# EAGLE design USBHost (EAGLE 5.10)
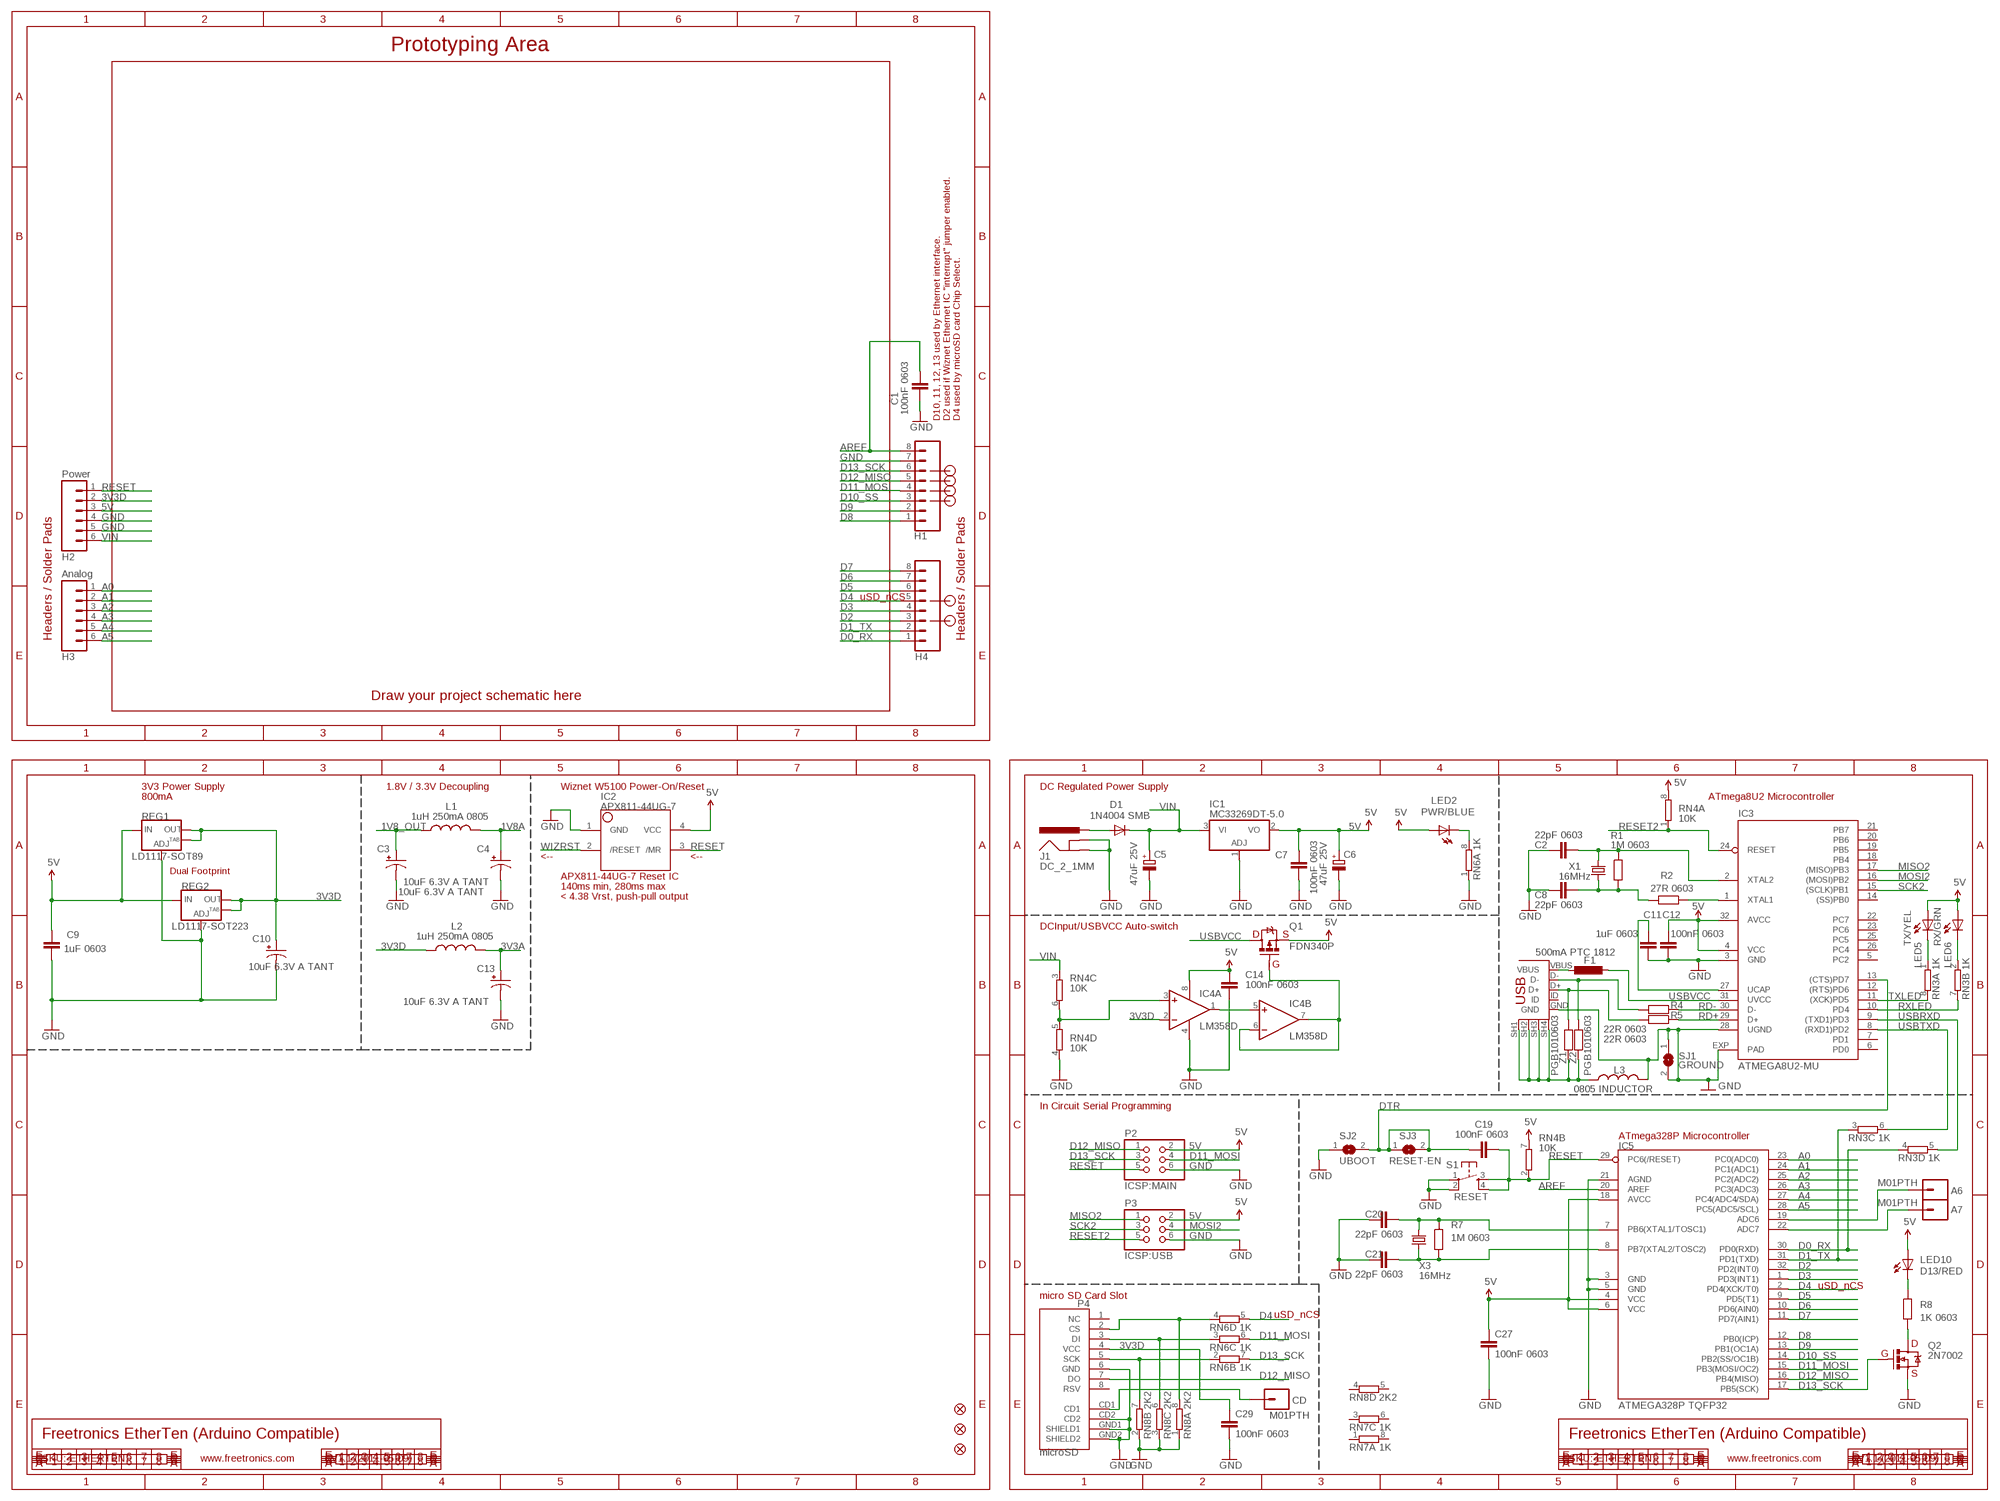
[diagram p0: schematic, sheet 1]

## Parts
A6  M01PTH  [1X01]
A7  M01PTH  [1X01]
C1  100nF 0603  CAP0603  [0603]
C2  22pF 0603  CAP0603  [0603]
C3  10uF 6.3V A TANT  CAP_POL1206  [EIA3216]
C4  10uF 6.3V A TANT  CAP_POL1206  [EIA3216]
C5  47uF 25V  CPOL-EUD  [PANASONIC_D]
C6  47uF 25V  CPOL-EUD  [PANASONIC_D]
C7  100nF 0603  CAP0603  [0603]
C8  22pF 0603  CAP0603  [0603]
C9  1uF 0603  CAP0603  [0603]
C10  10uF 6.3V A TANT  CAP_POL1206  [EIA3216]
C11  1uF 0603  CAP0603  [0603]
C12  100nF 0603  CAP0603  [0603]
C13  10uF 6.3V A TANT  CAP_POL1206  [EIA3216]
C14  100nF 0603  CAP0603  [0603]
C19  100nF 0603  CAP0603  [0603]
C20  22pF 0603  CAP0603  [0603]
C21  22pF 0603  CAP0603  [0603]
C27  100nF 0603  CAP0603  [0603]
C29  100nF 0603  CAP0603  [0603]
CD  M01PTH  [1X01]
D1  1N4004 SMB  DIODESMB  [SMB-DIODE]
F1  500mA PTC 1812  L-EUL1812  [L1812]
FID1  FIDUCIAL1X2.5  [FIDUCIAL-1X2.5]
FID2  FIDUCIAL1X2.5  [FIDUCIAL-1X2.5]
FID3  FIDUCIAL1X2.5  [FIDUCIAL-1X2.5]
H1  Digital_8_13  M08  [1X08]
H2  Power  M06SIP  [1X06]
H3  Analog  M06SIP  [1X06]
H4  Digital_0_7  M08  [1X08]
IC1  MC33269DT-5.0  MC33269D-5.0  [DPACK]
IC2  APX811-44UG-7  APX81X-RESET-IC  [SOT143-R]
IC3  ATMEGA8U2-MU  ATMEL_ATMEGA8U2-MUQFN  [ATMEL_QFN32]
IC4  LM358D  [SO08]
IC5  ATMEGA328P TQFP32  AVR-MEGA8-AI  [TQFP32-08]
J1  DC_2_1MM  POWER_JACKPTH  [POWER_JACK_PTH]
L1  1uH 250mA 0805  L-USL2012C  [L2012C]
L2  1uH 250mA 0805  L-USL2012C  [L2012C]
L3  0805 INDUCTOR  INDUCTOR0805-LARGE  [0805-LARGE]
LED2  PWR/BLUE  LED0603  [LED-0603]
LED5  TX/YEL  LED0603  [LED-0603]
LED6  RX/GRN  LED0603  [LED-0603]
LED10  D13/RED  LED0603  [LED-0603]
P1  USB-FT  [USB-MINIB-FT]
P2  ICSP:MAIN  PINHD-2X3  [2X03]
P3  ICSP:USB  PINHD-2X3  [2X03]
P4  microSD  USD-SOCKETNEW  [MICRO-SD-SOCKET-PP]
Q1  FDN340P  MOSFET-PCHANNEL  [SOT23]
Q2  2N7002  MOSFET-NCHANNELSMD  [SOT23-3]
R1  1M 0603  RESISTOR0603  [0603]
R2  27R 0603  RESISTOR0603  [0603]
R4  22R 0603  RESISTOR0603  [0603]
R5  22R 0603  RESISTOR0603  [0603]
R7  1M 0603  RESISTOR0603  [0603]
R8  1K 0603  RESISTOR0603  [0603]
REG1  LD1117-SOT89  V_REG_LM1117SOT89  [SOT89]
REG2  LD1117-SOT223  V_REG_LM1117SOT223  [SOT223]
RN3  1K  4R-NCAY16  [CAY16]
RN4  10K  4R-NCAY16  [CAY16]
RN6  1K  4R-NCAY16  [CAY16]
RN7  1K  4R-NCAY16  [CAY16]
RN8  2K2  4R-NCAY16  [CAY16]
S1  RESET  TAC_SWITCHSMD  [TACTILE_SWITCH_SMD]
SJ1  GROUND  SJ  [SJ]
SJ2  UBOOT  SJ  [SJ]
SJ3  RESET-EN  SJ  [SJ]
X1  16MHz  CRYSTALHC49UV  [HC49U-V]
X3  16MHz  CRYSTALHC49UV  [HC49U-V]
Z1  PGB1010603  RESISTOR0603  [0603]
Z2  PGB1010603  RESISTOR0603  [0603]

## Nets
1V8_OUT: C3.A(+) L1.1
1V8A: C4.A(+) L1.2
3V3A: C13.A(+) L2.2
3V3D: C10.A(+) C29.1 H2.2 IC4.2(A:-IN) L2.1 P4.4(VCC) REG1.2(OUT) REG1.4(OUT) REG2.2(OUT) REG2.4(OUT)
5V [power]: C6.+ C7.1 C9.1 C12.1 C14.1 C27.1 H2.3 IC1.2(VO) IC2.4(VCC) IC3.4(VCC) IC3.32(AVCC) IC4.8(P:V+) IC5.4(VCC) IC5.6(VCC) IC5.18(AVCC) LED2.A LED5.A LED6.A LED10.A P2.2 P3.2 Q1.2(S) REG1.3(IN) REG2.3(IN) RN4.7 RN4.8
A0: H3.1 IC5.23(PC0(ADC0))
A1: H3.2 IC5.24(PC1(ADC1))
A2: H3.3 IC5.25(PC2(ADC2))
A3: H3.4 IC5.26(PC3(ADC3))
A4: H3.5 IC5.27(PC4(ADC4/SDA))
A5: H3.6 IC5.28(PC5(ADC5/SCL))
AREF: C1.1 H1.8 IC5.20(AREF)
D0_RX: H4.1 IC5.30(PD0(RXD)) RN3.4
D1_TX: H4.2 IC5.31(PD1(TXD)) RN3.3
D2: H4.3 IC5.32(PD2(INT0))
D3: H4.4 IC5.1(PD3(INT1))
D4: H4.5 IC5.2(PD4(XCK/T0)) RN6.5
D5: H4.6 IC5.9(PD5(T1))
D6: H4.7 IC5.10(PD6(AIN0))
D7: H4.8 IC5.11(PD7(AIN1))
D8: H1.1 IC5.12(PB0(ICP))
D9: H1.2 IC5.13(PB1(OC1A))
D10_SS: H1.3 IC5.14(PB2(SS/OC1B))
D11_MOSI: H1.4 IC5.15(PB3(MOSI/OC2)) P2.4 RN6.6
D12_MISO: H1.5 IC5.16(PB4(MISO)) P2.1 P4.7(DO)
D13_SCK: H1.6 IC5.17(PB5(SCK)) P2.3 Q2.1(G) RN6.7
DTR: C19.1 IC3.13((CTS)PD7) SJ2.2 SJ3.1 SJ3.2
GND: C1.2 C2.1 C3.C(-) C4.C(-) C5.- C6.- C7.2 C8.1 C9.2 C10.C(-) C11.2 C12.2 C13.C(-) C14.2 C20.1 C21.1 C27.2 C29.2 H1.7 H2.4 H2.5 IC1.1(ADJ) IC2.1(GND) IC3.3(GND) IC3.28(UGND) IC3.EXP(PAD) IC4.4(P:V-) IC5.3(GND) IC5.5(GND) IC5.21(AGND) J1.GND J1.GNDBREAK L3.2 P1.GND P2.6 P3.6 P4.6(GND) P4.CD2 P4.GND1(SHIELD1) P4.GND2(SHIELD2) Q2.2(S) REG1.1(ADJ) REG2.1(ADJ) RN4.4 RN6.1 RN8.1 RN8.2 RN8.3 S1.1 S1.2 SJ1.1 SJ1.2 SJ2.1
MISO2: IC3.17((MISO)PB3) P3.1
MOSI2: IC3.16((MOSI)PB2) P3.4
N$2: C20.2 IC5.7(PB6(XTAL1/TOSC1)) R7.2 X3.2
N$4: LED10.C R8.2
N$6: Q2.3(D) R8.1
N$7: C21.2 IC5.8(PB7(XTAL2/TOSC2)) R7.1 X3.1
N$8: IC3.1(XTAL1) R2.1
N$9: L3.1 P1.SH1(SH$1) P1.SH2(SH$2) P1.SH3(SH$3) P1.SH4(SH$4) Z1.2 Z2.2
N$11: LED6.C RN3.2
N$12: IC4.3(A:+IN) RN4.5 RN4.6
N$13: LED5.C RN3.1
N$14: LED2.C RN6.8
N$16: P1.D+ R5.2 Z1.1
N$17: P1.D- R4.2 Z2.1
N$18: IC4.6(B:-IN) IC4.7(B:OUT) Q1.1(G)
N$19: IC4.1(A:OUT) IC4.5(B:+IN)
N$20: P4.2(CS) RN6.4 RN8.8
N$21: A7.1 IC5.22(ADC7)
N$22: A6.1 IC5.19(ADC6)
N$23: CD.1 P4.CD1
N$24: P4.5(SCK) RN6.2 RN8.7
N$25: P4.3(DI) RN6.3 RN8.6
N$60: D1.A J1.PWR
N$113: C2.2 IC3.2(XTAL2) R1.2 X1.2
N$114: C8.2 R1.1 R2.2 X1.1
N$115: F1.1 P1.VBUS
N$117: C11.1 IC3.27(UCAP)
RD+: IC3.29(D+) R5.1
RD-: IC3.30(D-) R4.1
RESET: C19.2 H2.1 IC2.3(/MR) IC5.29(PC6(/RESET)) P2.5 RN4.2 S1.3 S1.4
RESET2: IC3.24(RESET) P3.5 RN4.1
RXLED: IC3.10(PD4) RN3.7
SCK2: IC3.15((SCLK)PB1) P3.3
TXLED: IC3.11((XCK)PD5) RN3.8
USBRXD: IC3.9((TXD1)PD3) RN3.5
USBTXD: IC3.8((RXD1)PD2) RN3.6
USBVCC: F1.2 IC3.31(UVCC) Q1.3(D)
VIN: C5.+ D1.C H2.6 IC1.3(VI) RN4.3
WIZRST: IC2.2(/RESET)
Unconnected: IC3.5(PC2) IC3.6(PD0) IC3.7(PD1) IC3.12((RTS)PD6) IC3.14((SS)PB0) IC3.18(PB4) IC3.19(PB5) IC3.20(PB6) IC3.21(PB7) IC3.22(PC7) IC3.23(PC6) IC3.25(PC5) IC3.26(PC4) P1.ID P4.1(NC) P4.8(RSV) RN7.1 RN7.2 RN7.3 RN7.4 RN7.5 RN7.6 RN7.7 RN7.8 RN8.4 RN8.5

## Notes on the sheet
- Prototyping Area
- D10, 11, 12, 13 used by Ethernet interface. | D2 used if Wiznet Ethernet IC "interrupt" jumper enabled. | D4 used by microSD card Chip Select.
- uSD_nCS
- Headers / Solder Pads | Headers / Solder Pads
- Draw your project schematic here
- 3V3 Power Supply | 1.8V / 3.3V Decoupling | Wiznet W5100 Power-On/Reset | DC Regulated Power Supply
- 800mA | ATmega8U2 Microcontroller
- <-- | <--
- Dual Footprint
- APX811-44UG-7 Reset IC
- 140ms min, 280ms max
- < 4.38 Vrst, push-pull output
- DCInput/USBVCC Auto-switch
- D | S
- G
- In Circuit Serial Programming
- ATmega328P Microcontroller
- uSD_nCS
- micro SD Card Slot
- uSD_nCS
- D
- G
- S
- Freetronics EtherTen (Arduino Compatible) | Freetronics EtherTen (Arduino Compatible)
- SKU: ETHERTEN | www.freetronics.com | V1.1 (2011-05-09) | SKU: ETHERTEN | www.freetronics.com | V1.1 (2011-05-09)

## Library data of the parts
A6 A7 CD = freetronics-2:M01: Header 1 Standard 1-pin 0.1" header. Use with straight break away headers (SKU : PRT-00116), right angle break away headers (PRT-00553), swiss pins (PRT-00743), machine pins (PRT-00117), and female headers (PRT-00115).
C1 C2 C7-C9 C11 C12 C14 C19-C21 C27 C29 = freetronics:CAP: Capacitor Standard 0603 ceramic capacitor, and 0.1" leaded capacitor.
C3 C4 C10 C13 = freetronics:CAP_POL: Capacitor Polarized These are standard SMD and PTH capacitors. Normally 10uF, 47uF, and 100uF in electrolytic and tantalum varieties. Always verify the external diameter of the through hole cap, it varies with capacity, voltage, and manufacturer. The EIA devices should be standard.
C5 C6 = rcl:CPOL-EU: POLARIZED CAPACITOR, European symbol
D1 = freetronics:DIODE: Diode These are standard reverse protection diodes and small signal diodes. SMA package can handle up to about 1A. SOD-323 can handle about 200mA. What the SOD-323 package when ordering, there are some mfgs out there that are 5-pin packages.
F1 = rcl:L-EU: INDUCTOR, European symbol
FID1-FID3 = freetronics:FIDUCIAL: Fiducial Alignment Points Various fiducial points for machine vision alignment.
H1 H4 = freetronics:M08: Header 8 Standard 8-pin 0.1" header. Use with straight break away headers (SKU : PRT-00116), right angle break away headers (PRT-00553), swiss pins (PRT-00743), machine pins (PRT-00117), and female headers (PRT-00115).
H2 H3 = freetronics:M06: Header 6 Standard 6-pin 0.1" header. Use with straight break away headers (SKU : PRT-00116), right angle break away headers (PRT-00553), swiss pins (PRT-00743), machine pins (PRT-00117), and female headers (PRT-00115). Molex polarized connector foot print use with SKU : PRT-08094 with associated crimp pins and housings. NOTES ON THE VARIANTS LOCK and LOCK_LONGPADS... This footprint was designed to help hold the alignment of a through-hole component (i.e. 6-pin header) while soldering it into place. You may notice that each hole has been shifted either up or down by 0.005 of an inch from it's more standard position (which is a perfectly straight line). This slight alteration caused the pins (the squares in the middle) to touch the edges of the holes. Because they are alternating, it causes a "brace" to hold the component in place. 0.005 has proven to be the perfect amount of "off-center" position when using our standard breakaway headers. Although looks a little odd when you look at the bare footprint, once you have a header in there, the alteration is very hard to notice. Also, if you push a header all the way into place, it is covered up entirely on the bottom side. This idea of altering the position of holes to aid alignment will be further integrated into the Sparkfun Library for other footprints. It can help hold any component with 3 or more connection pins.
IC1 = linear:MC33269?*: Adjustable Output Low Dropout Voltage Regulator 800 mA Source: http://www.onsemi.com/pub/Collateral/MC33269-D.PDF
IC2 = freetronics-master-v1:APX81X-RESET-IC
IC3 = freetronics-jon:ATMEL_ATMEGA8U2-MU
IC4 = linear:LM358: OP AMP also LM158; LM258; LM2904 Source: http://cache.national.com/ds/LM/LM158.pdf
IC5 = freetronics-2:AVR-MEGA8: MICROCONTROLLER 8 Kbytes FLASH 1 kbytes SRAM 512 bytes EEPROM USART 6-channel 10 bit ADC 2-channel 8 bit ADC
J1 = freetronics:POWER_JACK: Power Jack This is the standard 5.5mm barrel jack for power. The PTH is the most common, proven, reliable, footprint. All others are experimental. The Slot footprint only works if the mill layer is transmitted to the PCB fab house so be warned. Spark Fun Electronics SKU : PRT-00119. Mating wall wart : TOL-00298 (and others)
L1 L2 = rcl:L-US: INDUCTOR, American symbol
L3 = freetronics-master-v1:INDUCTOR: Inductors Basic Inductor/Choke - 0603 and 1206. Footprints are not proven and vary greatly between part numbers.
LED2 LED5 LED6 LED10 = freetronics:LED: LEDs Standard schematic elements and footprints for 5mm, 3mm, 1206, and 0603 sized LEDs. 5mm - Spark Fun Electronics SKU : COM-00529 (and others)
P1 = freetronics-master-v1:USB-FT
P2 P3 = pinhead:PINHD-2X3: PIN HEADER
P4 = freetronics-master-v1:USD-SOCKET: microSD Socket Push-push type uSD socket. Schematic element and footprint production proven. Spark Fun Electronics SKU : PRT-00127. tDoc lines correctly indicate media card edge positions when inserting (unlocked, locked, depressed).
Q1 = freetronics-master-v1:MOSFET-PCHANNEL
Q2 = freetronics:MOSFET-NCHANNEL
R1 R2 R4 R5 R7 R8 Z1 Z2 = freetronics:RESISTOR: Resistor Basic schematic elements and footprints for 0603, 1206, and PTH 1/10th watt (small) resistors.
REG1 REG2 = freetronics:V_REG_LM1117: Voltage Regulator LD1117 Adjustable low-dropout voltage regulator available in SOT89 and SOT223 SMT packages.
RN3 RN4 RN6-RN8 = freetronics-master-v1:4R-N: Array Chip Resistor Source: RS Component / Phycomp
S1 = freetronics:TAC_SWITCH: Momentary Switch Button commonly used for reset or general input. Spark Fun Electronics SKU : COM-00097
SJ1-SJ3 = jumper:SJ: SMD solder JUMPER
X1 X3 = freetronics-master-v1:CRYSTAL: Crystals Various standard crystals. Proven footprints. Spark Fun Electronics SKU : COM-00534

## Board
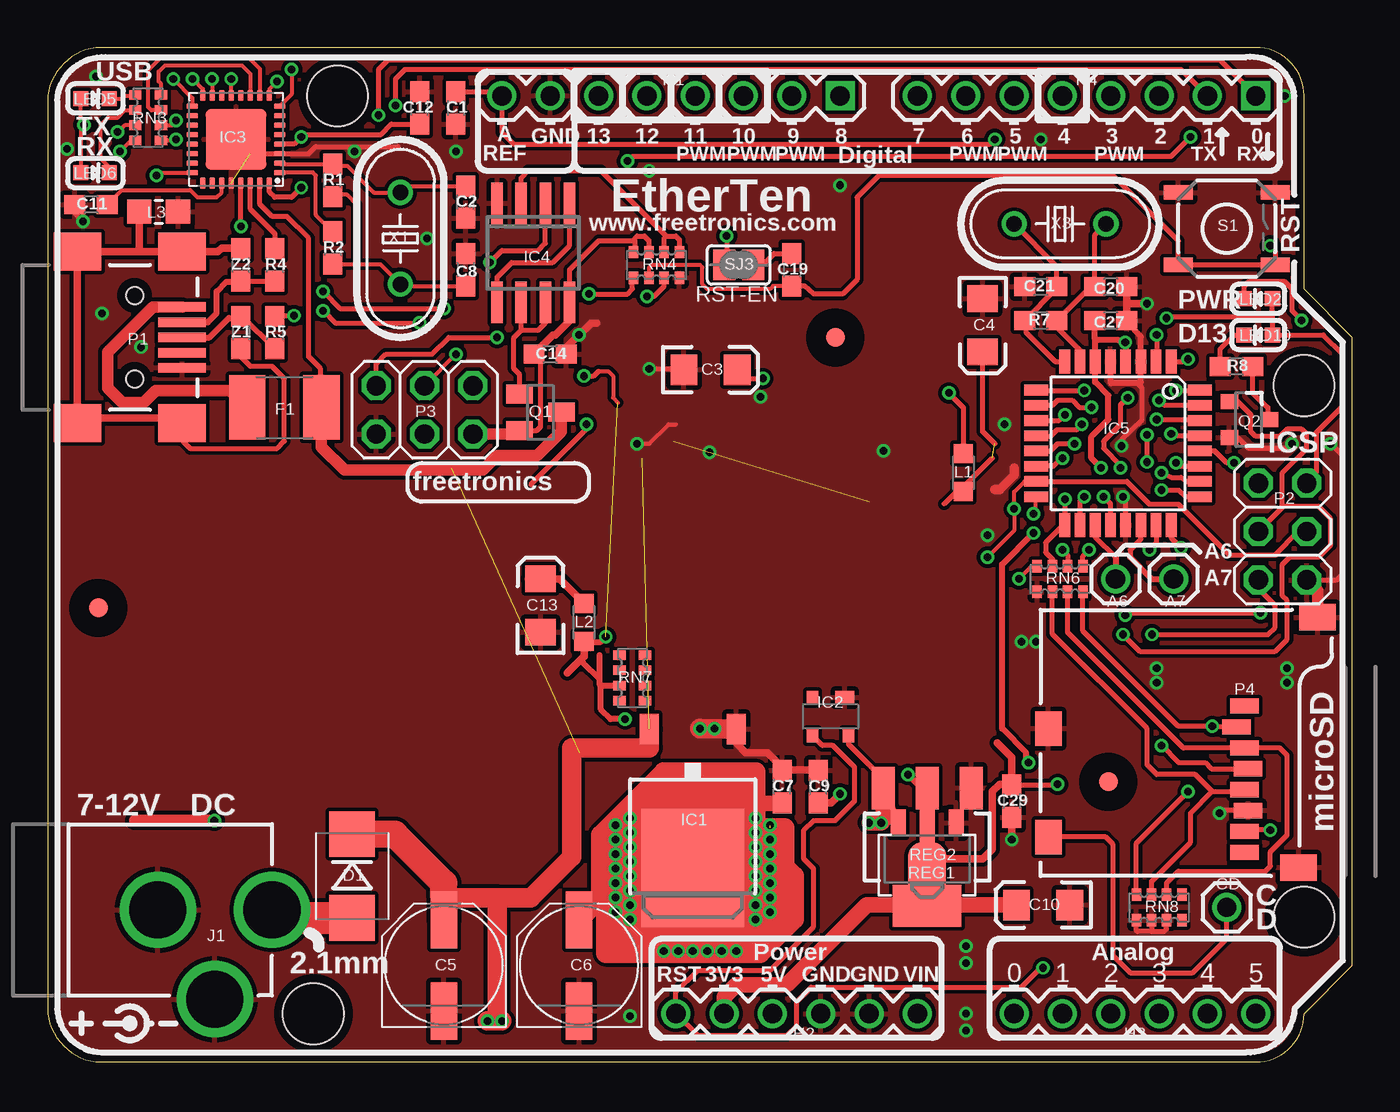
[diagram p1: board, top side]
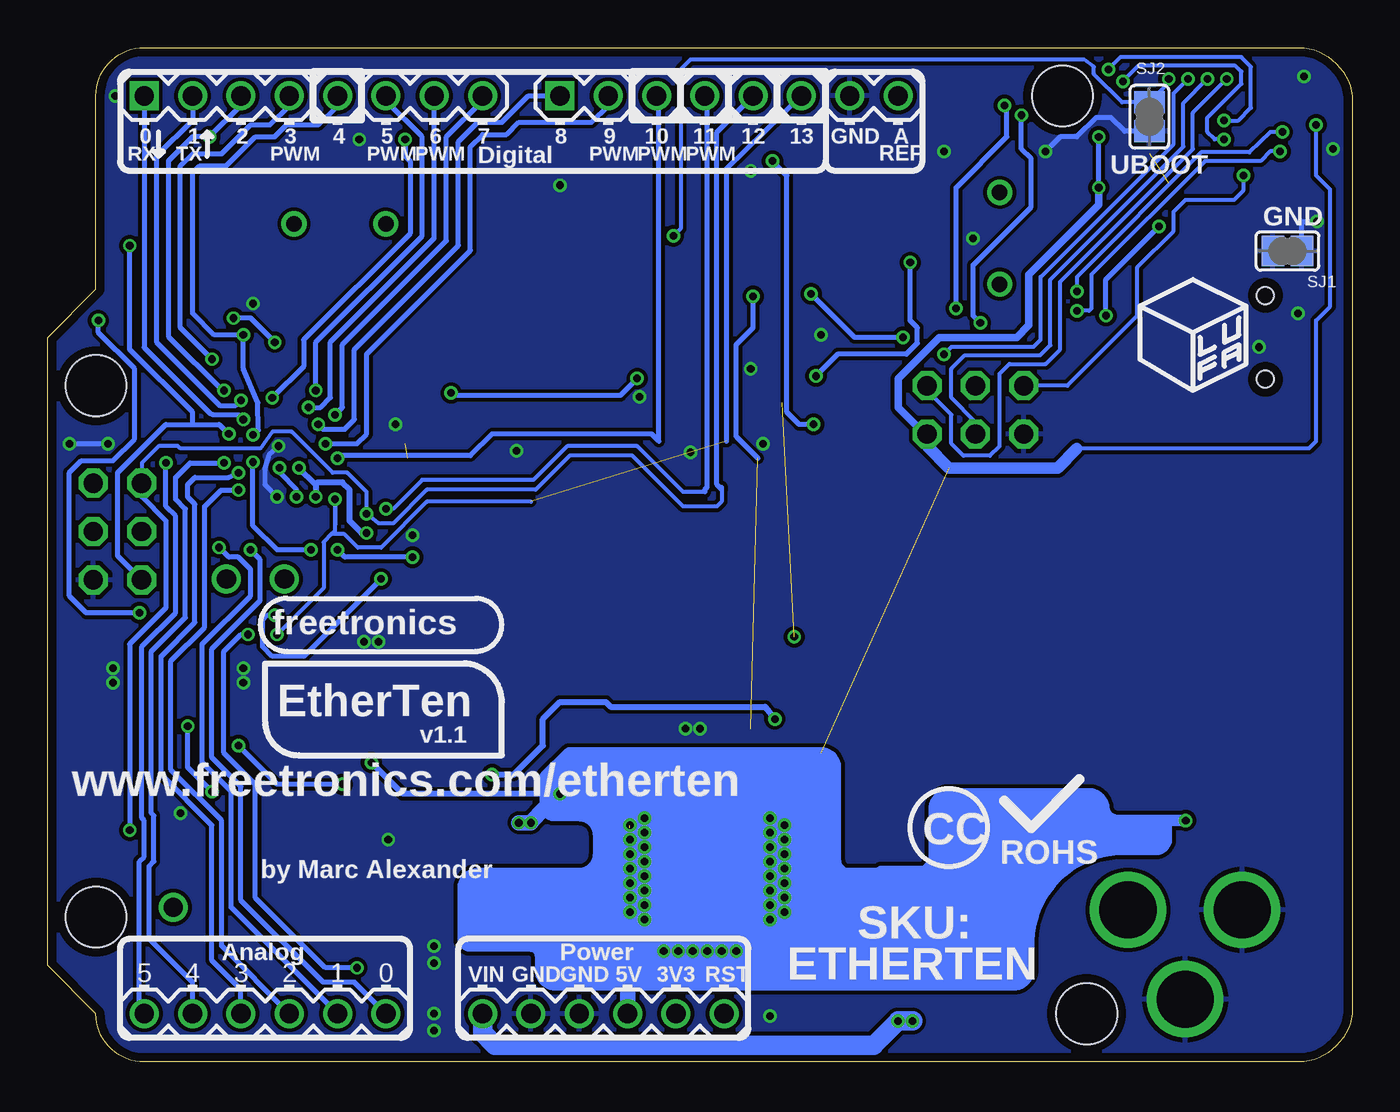
[diagram p2: board, bottom side, seen from below]

Size 68.58 x 53.34 mm. Coordinates in mm from the lower left corner, seen from the top.
Outline: 0,2.54 arc74 2.54,0 63.5,0 arc90 66.04,2.54 68.58,5.08 68.58,38.1 66.04,40.64 66.04,50.8 arc90 63.5,53.34 2.54,53.34 arc74 0,50.8 0,2.54
Copper layers (1*16): Top 0.035mm / dielectric 1.5mm / Bottom 0.035mm
Design rules "default *": minimum track width 8mil, minimum drill 15mil, track to track 8mil, track to pad 8mil, pad to pad 8mil, via to via 8mil, smd to smd 8mil, copper to edge 18mil, drill to drill 8mil, minimum pad ring 10mil, minimum via ring 6mil, stop-mask expansion 4mil, vias tented up to drill 25mil, thermal gap 10mil
Holes 3.2 mm at 66.04,35.56 66.04,7.62 13.97,2.54 15.24,50.8
tRestrict: area 40.4,37.1 to 42.4,39.1; area 54.7,13.7 to 56.8,15.7; area 1.7,22.9 to 3.7,24.9

### Footprints (pad centres in the part's own frame; a part is rotated, then mirrored left to right if it is on the bottom)
1X01 = drill 1.016 round: 1 0,0
0603 = smd 1.1 x 1: 1 -0.85,0; 2 0.85,0
EIA3216 = smd 1.4 x 1.6: A 1.4,0; C -1.4,0
PANASONIC_D = smd 3 x 1.4: + 2.4,0; - -2.4,0
SMB-DIODE = smd 2.4 x 2.4: A 2.2,0; C -2.2,0
L1812 = smd 1.9 x 3.4: 1 -1.95,0; 2 1.95,0
FIDUCIAL-1X2.5 = smd 1 x 1: 1 0,0
1X08 = drill 1.016 square: 1 0,0 | drill 1.016 round: 2 2.54,0; 3 5.08,0; 4 7.62,0; 5 10.16,0; 6 12.7,0; 7 15.24,0; 8 17.78,0
1X06 = drill 1.016 round: 1 0,0; 2 2.54,0; 3 5.08,0; 4 7.62,0; 5 10.16,0; 6 12.7,0
DPACK = smd 1 x 1.6: 1 -2.28,-4.8; 3 2.28,-4.8 | smd 5.4 x 6.2: 2 0,2.5
SOT143-R = smd 1 x 0.7: 1 -0.75,-1 | smd 0.6 x 0.7: 2 0.95,-1; 3 0.95,1; 4 -0.95,1
ATMEL_QFN32 = smd 0.6 x 0.3: 1 -2.3,1.75; 2 -2.3,1.25; 3 -2.3,0.75; 4 -2.3,0.25; 5 -2.3,-0.25; 6 -2.3,-0.75; 7 -2.3,-1.25; 8 -2.3,-1.75; 17 2.3,-1.75; 18 2.3,-1.25; 19 2.3,-0.75; 20 2.3,-0.25; 21 2.3,0.25; 22 2.3,0.75; 23 2.3,1.25; 24 2.3,1.75 | smd 0.3 x 0.6: 9 -1.75,-2.3; 10 -1.25,-2.3; 11 -0.75,-2.3; 12 -0.25,-2.3; 13 0.25,-2.3; 14 0.75,-2.3; 15 1.25,-2.3; 16 1.75,-2.3; 25 1.75,2.3; 26 1.25,2.3; 27 0.75,2.3; 28 0.25,2.3; 29 -0.25,2.3; 30 -0.75,2.3; 31 -1.25,2.3; 32 -1.75,2.3 | smd 3.2 x 3.2: EXP 0,0
SO08 = smd 0.6 x 2.2: 1 -1.905,-2.6; 2 -0.635,-2.6; 3 0.635,-2.6; 4 1.905,-2.6; 5 1.905,2.6; 6 0.635,2.6; 7 -0.635,2.6; 8 -1.905,2.6
TQFP32-08 = smd 1.27 x 0.559: 1 -4.293,2.8; 2 -4.293,2; 3 -4.293,1.2; 4 -4.293,0.4; 5 -4.293,-0.4; 6 -4.293,-1.2; 7 -4.293,-2; 8 -4.293,-2.8; 17 4.293,-2.8; 18 4.293,-2; 19 4.293,-1.2; 20 4.293,-0.4; 21 4.293,0.4; 22 4.293,1.2; 23 4.293,2; 24 4.293,2.8 | smd 0.559 x 1.27: 9 -2.8,-4.293; 10 -2,-4.293; 11 -1.2,-4.293; 12 -0.4,-4.293; 13 0.4,-4.293; 14 1.2,-4.293; 15 2,-4.293; 16 2.8,-4.293; 25 2.8,4.293; 26 2,4.293; 27 1.2,4.293; 28 0.4,4.293; 29 -0.4,4.293; 30 -1.2,4.293; 31 -2,4.293; 32 -2.8,4.293
POWER_JACK_PTH = drill 2.997 round: GND 0,7.7; GNDBREAK 4.7,10.7; PWR 0,13.7
L2012C = smd 1 x 1: 1 -1,0; 2 1,0
0805-LARGE = smd 1.27 x 1.27: 1 -1.016,0; 2 1.016,0
LED-0603 = smd 0.8 x 0.8: A 0,-0.75; C 0,0.75
USB-MINIB-FT = smd 2.5 x 0.5: D+ 2.5,0; D- 2.5,0.8; GND 2.5,-1.6; ID 2.5,-0.8; VBUS 2.5,1.6 | smd 2.5 x 2: SH1 -3,-4.5; SH2 -3,4.5; SH3 2.5,4.5; SH4 2.5,-4.5 | hole 0.9: 0,2.2; 0,-2.2
2X03 = drill 1.016 octagon: 1 -2.54,-1.27; 2 -2.54,1.27; 3 0,-1.27; 4 0,1.27; 5 2.54,-1.27; 6 2.54,1.27
MICRO-SD-SOCKET-PP = smd 0.8 x 1.5: 1 -8.94,10.7; 2 -7.84,10.3; 3 -6.74,10.7; 4 -5.64,10.9; 5 -4.54,10.7; 6 -3.44,10.9; 7 -2.34,10.7; 8 -1.24,10.7 | smd 1.8 x 1.4: CD1 -2.05,0.4; CD2 -7.75,0.4 | smd 1.4 x 1.9: GND1 -0.45,13.55; GND2 -13.6,14.55
SOT23 = smd 1 x 1.4: 1 -0.95,-1.1; 2 0.95,-1.1; 3 0,1.1
SOT23-3 = smd 0.8 x 0.9: 1 -0.95,-1; 2 0.95,-1; 3 0,1.1
SOT89 = smd 0.8 x 1.4: 1 -1.524,-1.905; 3 1.524,-1.905 | smd 0.8 x 1.9: 2 0,-1.651 | smd 2.032 x 3.65: 4 0,0.94
SOT223 = smd 1.219 x 2.235: 1 -2.311,-3.099; 2 0,-3.099; 3 2.311,-3.099 | smd 3.6 x 2.2: 4 0,3.099
CAY16 = smd 0.5 x 0.65: 1 -1.2,-0.675; 2 -0.4,-0.675; 3 0.4,-0.675; 4 1.2,-0.675; 5 1.2,0.675; 6 0.4,0.675; 7 -0.4,0.675; 8 -1.2,0.675
TACTILE_SWITCH_SMD = smd 1.524 x 0.762: 1 -2.54,1.905; 2 2.54,1.905; 3 -2.54,-1.905; 4 2.54,-1.905
SJ = smd 1.168 x 1.6: 1 -0.762,0; 2 0.762,0
HC49U-V = drill 0.813 round: 1 -2.413,0; 2 2.413,0

### Placement (x,y rotation side)
A6  56.13,25.4 0 top
A7  59.18,25.4 0 top
C1  21.46,50.16 270 top
C2  21.97,45.21 90 top
C3  34.85,36.4 0 top
C4  49.15,38.73 270 top
C5  20.83,5.08 90 top
C6  27.94,5.08 90 top
C7  38.61,14.48 90 top
C8  21.97,41.66 270 top
C9  40.51,14.48 90 top
C10  52.32,8.26 180 top
C11  2.29,45.09 180 top
C12  19.56,50.16 90 top
C13  25.91,24 90 top
C14  26.42,37.21 0 top
C19  39.12,41.66 270 top
C20  55.88,40.77 180 top
C21  52.2,40.77 0 top
C27  55.88,38.99 0 top
C29  50.67,13.72 270 top
CD  61.98,8.13 0 top
D1  16,9.78 270 top
F1  12.45,34.42 0 top
FID1  41.4,38.1 0 top
FID2  55.75,14.73 0 top
FID3  2.67,23.88 0 top
H1  41.66,50.8 180 top
H2  33.02,2.54 0 top
H3  50.8,2.54 0 top
H4  63.5,50.8 180 top
IC1  33.91,12.7 180 top
IC2  41.15,18.16 180 top
IC3  9.91,48.51 180 top
IC4  25.53,42.55 180 top
IC5  56.26,32.53 270 top
J1  -1.91,8 270 top
L1  48.13,30.99 270 top
L2  28.19,23.11 90 top
L3  5.84,44.7 0 top
LED2  63.63,40.13 90 top
LED5  2.5,50.65 270 top
LED6  2.5,46.76 270 top
LED10  63.63,38.23 90 top
P1  4.57,38.1 0 top
P2  64.91,27.89 270 top
P3  19.81,34.29 180 top
P4  52.2,9.78 270 top
Q1  25.91,34.16 270 top
Q2  63.12,33.78 270 top
R1  14.99,46.35 90 top
R2  14.99,42.8 270 top
R4  11.94,41.91 270 top
R5  11.94,38.35 270 top
R7  52.2,38.99 0 top
R8  62.48,36.58 180 top
REG1  46.23,10.67 180 top
REG2  46.23,11.3 180 top
RN3  5.28,49.66 270 top
RN4  32,41.91 0 top
RN6  53.21,25.4 0 top
RN7  30.73,20.19 90 top
RN8  58.42,8.13 0 top
S1  61.98,43.81 0 top
SJ1  3.41,42.64 0 bottom
SJ2  10.67,49.7 90 bottom
SJ3  36.32,41.91 0 top
X1  18.54,43.31 90 top
X3  53.21,44.07 0 top
Z1  10.16,38.35 270 top
Z2  10.16,41.91 90 top

### Tracks (layer width: path | path; a pad name or v marks a point on that pad's centre or on a via)
1V8_OUT  (via drill 0.4)
  Top 0.254: 36.63,36.14 C3.A 36.7,35.94 v37.59,35.94 | L1.1 48.13,34.42 v47.37,35.18
  Bottom 0.254: v37.59,35.94 38.48,35.05 47.24,35.05 v47.37,35.18
1V8A  (1 unrouted)
  Top 0.254: 47.12,29.34 47.75,29.97 48.13,29.97 L1.2 48.13,30.23 49.66,31.75 | 49.78,32.51 49.15,33.15 C4.A
3V3A
  Top 0.406: C13.A 25.27,25.4 26.92,25.4 L2.2
3V3D  (via drill 0.4)  (1 unrouted)
  Top 0.203: 28.96,36.32 29.46,36.32 29.72,36.07 29.72,34.92 29.97,34.67
  Top 0.254: P4.4 61.16,15.42 60.83,15.75 59.44,15.75 v58.55,16.64 | v53.09,14.61 53.05,14.57 C29.1 | IC4.2 26.16,43.05 25.78,42.67 23.88,42.67 v23.24,42.04 | v28.19,36.07 28.7,36.07 28.96,36.32
  Top 0.305: 29.08,19.81 30.04,19.81 | 29.02,20.13 28.13,21.02 28.13,21.27 | 29.02,20.13 29.02,21.39 | REG2.4 REG1.4 | 28.19,22.1 29.08,22.1 v29.34,22.35 | 29.08,19.81 29.02,19.88 29.02,20.13 | 29.08,19.81 29.08,18.54 29.59,18.03 v30.35,18.03 | v45.21,15.11 45.97,14.35 REG2.2
  Top 0.406: REG1.4 46.23,10.67 | 46.23,10.67 REG1.2 REG2.2 | 27.3,20.45 28.13,21.27 28.19,21.34 28.19,22.1 L2.1 | 46.23,10.67 49.15,10.67 49.66,11.18 49.66,14.22 50.04,14.61 50.63,14.61 C29.1 50.67,16 49.91,16.76
  Top 0.813: H2.2 35.56,3.43 36.2,4.06 38.86,4.06 41.27,6.48 43.05,8.25 C10.A 46.18,8.26 REG2.4
  Bottom 0.254: v58.55,16.64 56.52,14.61 v53.09,14.61 | v23.24,42.04 23.24,38.99 22.86,38.61 22.86,37.8 23.44,37.21 27.05,37.21 v28.19,36.07
  Bottom 0.305: v30.35,18.03 30.86,18.67 38.99,18.67 39.24,18.92 41.66,18.92 42.55,18.03 42.55,16.64 44.07,15.11 v45.21,15.11
5V  (via drill 0.4)  (2 unrouted)
  Top 0.203: 1.75,49.28 LED5.A | 1.75,49.28 LED6.A | v1.91,49.28 1.75,49.28 | IC1.2 34.04,10.2 34.04,10.16 | 37.21,13.59 37.08,13.59 v37.21,12.83
  Top 0.254: IC3.4 12.95,48.26 v13.34,48.64 13.46,48.77 17.53,48.77 18.07,49.31 C12.1 | IC3.32 11.66,45.75 11.94,45.47 12.83,45.47 v13.34,45.97 | REG2.3 43.92,14.88 42.1,16.7 IC2.4 | 64.38,39.19 LED10.A 67.06,38.23 68.07,37.21 68.07,34.48 66.67,33.08 66.67,30.99 66.18,30.49 P2.2 | 64.38,39.19 LED2.A | IC5.18 54.26,29.5 v54.48,29.72 | RN4.7 31.6,43.2 31.37,43.43 30.99,43.43 30.86,43.31 30.86,43.18 | 30.86,43.18 30.86,42.64 RN4.8 | IC4.8 27.43,41.66 28.96,43.18 30.86,43.18 | C14.1 25.91,36.87 25.91,33.4 25.72,33.21 Q1.2 | 64.38,39.19 58.85,39.19 v58.8,39.12 | v56.64,37.85 56.64,37.83 56.53,37.72 | 29.84,10.41 v29.84,10.16 | 29.72,9.78 29.84,9.65 v29.84,9.4 | v29.84,7.87 v29.84,8.64 30.23,8.64
  Top 0.305: IC5.4 56.66,37.59 56.53,37.72 56.26,37.97 55.12,37.97 | 55.12,37.97 55.03,38.06 C27.1 | 55.12,37.97 55.06,37.92 IC5.6 55.06,35.74 55.75,35.05 55.75,33.78 54.86,32.89 54.86,31.75 v55.37,31.24 | v51.82,27.81 50.16,26.16 50.16,17.53 51.44,16.26 51.44,15.88 v51.56,15.75
  Top 0.406: REG2.3 REG1.3 | 38.57,13.59 C7.1 | C9.1 41.19,13.63 v41.66,14.1 | IC4.8 27.43,38.99 26.67,38.23 26.54,38.23 25.57,37.25 C14.1
  Top 0.61: Q1.2 24.61,33.02 P3.2 | 4.57,12.7 v8.76,12.7 | v36.2,5.84 v35.43,5.84 v34.67,5.84 v33.91,5.84 v33.15,5.84 v32.38,5.84 | v36.2,5.84 36.2,6.1 36.45,6.1 | 36.45,6.48 36.45,5.84 v36.2,5.84 | 30.23,10.67 30.23,10.54 v30.61,10.54
  Top 0.813: 37.21,13.59 38.57,13.59 | v30.61,7.49 v30.61,10.54 v30.61,12.83 30.86,12.83 | v37.21,7.49 v37.21,8.26 v37.21,9.02 37.21,12.32 v37.21,12.83 | REG2.3 43.92,12.68 v43.81,12.57 v43.18,12.57
  Top 1.016: C6.+ 30.66,10.2 IC1.2 | 34.04,15.24 34.04,10.16 | 34.04,15.24 32.38,15.24 29.08,11.94 29.08,8.89 29.34,9.78 | 29.34,9.78 29.34,5.71 37.21,5.71 | 37.21,5.71 37.21,12.32 | 37.21,12.32 37.21,13.59 37.21,15.24 34.04,15.24 | 29.34,9.78 29.72,9.78 30.86,10.92 30.86,12.83 32.64,14.61 36.45,14.61 36.45,6.48 30.23,6.48 30.23,8.64 30.99,9.4 30.99,6.99 35.94,6.99 35.94,13.84 32.26,13.84 32,13.59 36.07,13.59 | 29.84,10.41 29.84,12.19 30.23,12.19 30.23,10.67 | 37.21,5.71 37.47,5.71 39.24,7.49 39.24,9.78 38.73,10.29 38.73,12.32 38.61,12.32 | 37.97,12.32 38.61,12.32 | 37.21,12.32 37.97,12.32 | 37.97,12.32 v37.97,11.68 v37.97,10.92 v37.97,10.16 v37.97,9.4 v37.97,8.64 v37.97,7.87 37.97,6.73 | 38.61,12.32 38.61,6.99
  Bottom 0.203: v1.91,49.28 1.91,46.61 1.17,45.87 1.17,39.73 1.91,38.99 1.91,32.64 2.29,32.26 14.48,32.26
  Bottom 0.254: v13.34,45.97 v13.34,48.64 | v54.48,29.72 54.48,30.1 | v41.66,14.1 41.7,14.1 42.16,13.63 42.16,13.84 42.29,13.97 42.29,14.35 | v58.8,39.12 57.91,39.12 v56.64,37.85 | 42.42,13.34 42.44,13.35 | 42.29,13.21 42.16,13.34 | 40.26,14.73 40.39,14.86 40.64,14.86 | P3.2 22.48,33.02 | 21.97,12.7 21.84,12.57 21.84,12.45 | 21.84,11.94 21.97,11.81 21.97,11.56 21.84,11.56 | 21.97,11.18 21.84,11.18 | 21.97,10.92 21.84,10.79 21.84,10.41 | 15.11,10.41 17.02,10.29 15.62,10.03 15.88,9.78 15.88,9.65 16.26,9.27 16.51,9.02 16.51,8.89 | 17.27,8.13 17.27,7.87 | 21.21,14.1 21.21,13.84 | v29.84,11.68 v29.84,12.45 | v29.84,10.92 30.23,10.54 v30.61,10.54
  Bottom 0.305: 54.48,30.35 v55.37,31.24 | 54.48,30.35 v54.48,29.72 | 54.48,30.35 54.36,30.48 53.09,30.48 52.7,30.1 52.7,28.45 52.07,27.81 v51.82,27.81 | v51.56,15.75 49.91,14.1 v41.66,14.1
  Bottom 0.406: 22.48,33.02 23.88,34.42 23.88,35.94 21.72,38.1 17.65,38.1 17.02,38.73 17.02,41.4 13.34,45.09 v13.34,45.97
  Bottom 0.61: P3.2 22.35,32.38 21.21,31.24 15.49,31.24 14.48,32.26 | 9.78,12.7 9.78,11.81 arc90 10.29,11.18 11.81,11.18 arc-90 17.02,6.35 | 17.02,6.35 17.45,9.86 | 17.45,9.86 19.81,7.49 v30.61,7.49 | 41.17,16.26 41.1,16.08 | 42.42,13.46 42.42,13.34 42.29,13.21 42.16,13.08 39.5,13.08 | 42.29,14.35 42.16,14.48 | 42.16,14.48 40.77,15.88 | 42.16,13.84 40.64,15.37 | 42.16,13.34 40.64,14.86 | 40.26,14.73 41.78,13.21 | 17.45,9.86 26.37,9.86 arc90 27.18,10.67 27.18,15.49 arc-90 27.94,16.26 41.17,16.26 | 41.17,16.26 42.42,15.01 42.42,13.46 | 42.42,13.46 arc-90 41.91,12.95 40.64,12.95 arc90 39.62,11.94 39.62,11.68 | 39.62,11.18 39.62,10.92 arc90 40.64,9.91 45.97,9.91 arc-90 46.74,9.14 | 42.67,5.59 42.67,4.83 arc-90 41.91,4.06 17.78,4.06 arc-90 17.02,4.83 17.02,5.08 | 46.74,6.48 arc-90 46.35,6.1 43.18,6.1 | 46.74,6.99 46.74,7.49 | 46.74,8.13 46.74,8.64 | 17.02,6.1 17.02,5.59 | 17.02,6.6 17.02,7.11 | 17.02,7.62 17.02,9.14 | 17.02,9.14 arc-90 17.78,9.91 27.18,9.91 | 27.18,9.91 27.94,9.91 | 27.94,9.91 C6.+ | 17.02,9.14 46.74,9.14 | 46.74,9.14 46.74,8.64 | 46.74,8.64 17.27,8.64 17.27,8.13 46.74,8.13 | 46.74,7.49 46.74,8.13 | 17.02,7.62 46.74,7.49 | 17.02,7.11 17.02,7.62 | 17.02,7.11 46.74,6.99 | 46.74,6.48 46.74,6.99 | 17.02,6.6 46.74,6.48 | 17.02,6.35 17.02,6.6 | 17.02,6.35 17.02,6.1 | 17.02,6.1 43.18,6.1 | 43.18,6.1 arc90 42.67,5.59 | 17.02,5.59 42.67,5.59 | 17.02,5.59 17.02,5.08 | 17.02,5.08 42.42,5.08 42.42,4.57 17.53,4.57 17.27,7.87 | 17.27,7.87 17.14,9.53 | 17.14,9.53 42.16,9.4 42.16,9.65 39.62,9.65 39.62,9.91 27.94,9.91 | 27.18,9.91 27.18,10.16 39.62,10.16 39.62,10.67 27.43,10.67 27.43,11.18 39.62,11.18 | 39.62,11.18 39.62,11.68
  Bottom 0.61: 39.62,11.68 v29.84,11.68 27.43,11.68 27.43,12.19 39.37,12.19 39.37,12.45 | 39.37,12.45 39.62,12.45 | 39.37,12.45 v29.84,12.45 27.43,12.45 27.43,12.95 39.62,12.95 39.62,13.46 27.43,13.46 27.43,13.97 42.16,13.97 42.16,14.48 | 42.16,14.48 27.43,14.48 27.43,14.99 41.91,14.99 41.91,15.24 41.15,15.24 | 41.15,15.24 27.43,15.24 27.43,15.75 41.15,15.75 41.15,15.24 | 22.99,9.91 arc-90 21.97,10.92 21.97,11.18 21.97,11.56 21.97,12.7 | 21.97,13.34 21.97,12.95 | 21.97,12.95 21.97,12.7 | 21.97,13.34 arc90 21.21,14.1 13.84,14.1 arc90 13.08,13.34 13.08,13.46 arc-90 12.32,12.7 9.78,12.7 | v8.76,12.7 9.78,12.7 | 13.46,13.84 21.21,13.84 21.46,13.84 | 21.97,13.34 13.34,13.34 | 21.97,12.95 12.95,12.95 | 21.97,12.7 12.57,12.7 | 21.84,12.45 10.03,12.45 | 21.84,11.94 10.03,11.94 | 21.84,11.56 10.16,11.56 | 21.84,11.18 13.59,11.18 | 21.84,10.79 14.48,10.79 | 15.11,10.41 21.84,10.41 21.97,10.41 | 15.62,10.03 24.77,10.03 | 17.14,9.53 46.48,9.53 | 17.27,7.87 46.61,7.87 | 15.88,9.65 23.62,9.65 | 16.26,9.27 24,9.27 | 16.51,8.89 24.26,8.89
  Bottom 0.813: H2.3 38.1,6.6 37.97,6.6 v37.21,7.49 v37.21,8.26 v37.21,9.02 | v30.61,7.49 v30.61,8.26 v30.61,9.02 v30.61,9.78 v30.61,10.54 v30.61,11.3 | v30.61,12.06 v30.61,12.83 30.73,11.68 30.86,11.56 30.86,11.3 | v37.21,12.83 v37.21,12.06 v37.21,11.3 v37.21,10.54 v37.21,9.78 | v37.21,12.83 37.08,13.59 37.21,13.72 v37.21,12.83 | 43.22,12.57 v43.81,12.57 | 43.22,12.57 v43.18,12.57 | 43.22,12.57 42.44,13.35 42.16,13.63 37.88,13.63 v37.21,12.83
  other vias: 37.97,12.45
A0  (via drill 0.4)
  Top 0.254: v57.91,26.92 58.29,27.3 58.29,28.2 IC5.23
  Bottom 0.254: H3.1 52.45,4.19 54.1,4.19 58.42,8.51 58.42,14.48 59.94,16 59.94,21.72 57.4,24.26 57.4,26.42 v57.91,26.92
A1  (via drill 0.4)
  Top 0.254: v59.56,27.05 59.06,27.55 IC5.24
  Bottom 0.254: H3.2 58.93,8.13 58.93,14.22 60.45,15.75 60.45,21.97 57.91,24.51 57.91,25.91 58.55,26.54 59.05,26.54 v59.56,27.05
A2  (via drill 0.4)
  Top 0.254: IC5.25 59.81,29.73 59.46,30.07 v58.55,30.07
  Bottom 0.254: H3.3 59.44,6.1 59.44,12.7 62.1,15.37 62.1,21.08 60.33,22.86 60.33,29.21 59.46,30.07 v58.55,30.07
A3  (via drill 0.4)
  Top 0.254: IC5.26 59.87,30.53 59.56,30.73 59.05,30.73 v58.55,30.99
  Bottom 0.254: H3.4 58.42,3.81 59.94,5.33 59.94,12.45 62.61,15.11 62.61,21.34 60.83,23.11 60.83,29.34 61.21,29.72 61.21,30.35 60.83,30.73 59.05,30.73 v58.55,30.99
A4  (via drill 0.4)
  Top 0.254: IC5.27 59.48,31.33 v59.31,31.5
  Bottom 0.254: v59.31,31.5 61.09,31.5 61.85,30.73 61.85,29.59 61.34,29.08 61.34,23.37 63.12,21.59 63.12,13.08 62.99,12.95 62.99,10.54 63.25,10.29 63.25,6.48 60.96,4.19 H3.5
A5  (via drill 0.4)
  Top 0.254: IC5.28 61.34,32.13 61.98,31.5 v62.36,31.5
  Bottom 0.254: v62.36,31.5 62.36,29.21 61.85,28.7 61.85,23.62 63.63,21.84 63.63,12.83 63.5,12.7 63.5,10.79 63.75,10.54 63.75,2.79 H3.6
AREF  (via drill 0.4)
  Top 0.254: IC5.20 55.86,29.36 v55.5,29.72 | C1.1 23.66,51.02 H1.8 23.88,48.9 24.51,48.26 49.53,48.26 v49.78,48.51 | v56.39,31.24 56.39,31.37 55.5,32.26 55.5,32.64 56.39,33.53 56.39,34.54 v56.77,34.92
  Bottom 0.254: v55.5,29.72 55.5,30.1 56.39,30.99 v56.39,31.24 | v56.77,34.92 55.12,36.58 55.12,37.97 49.53,43.56 49.53,47.37 49.78,47.62 v49.78,48.51
D0_RX  (via drill 0.4)
  Top 0.203: RN3.4 4.39,48.46 v3.81,47.88
  Top 0.254: IC5.30 60.5,33.78 v58.29,33.78 | H4.1 61.59,52.7 17.91,52.7 17.4,52.2 v17.4,49.78 | v19.56,38.86 15.11,38.86 v14.48,39.5
  Bottom 0.203: v3.81,47.88 4.32,47.88 4.83,47.37 7.75,47.37 13.72,41.4 13.72,39.62 13.84,39.5 v14.48,39.5
  Bottom 0.254: H4.1 63.5,37.56 60.05,34.11 59.87,34.04 58.55,34.04 v58.29,33.78 | v17.4,49.78 17.4,48.01 16.89,47.5 16.89,44.96 19.94,41.91 19.94,39.24 v19.56,38.86
D1_TX  (via drill 0.4)
  Top 0.203: RN3.3 4.04,49.26 v3.68,48.9
  Top 0.254: IC5.31 60.54,34.54 58.67,34.54 v58.42,34.8 | H4.2 59.56,52.2 18.8,52.2 18.29,51.69 v18.29,50.29 | v14.48,40.51 15.37,39.62 v20.83,39.62
  Bottom 0.203: v3.68,48.9 4.32,48.9 5.41,47.83 7.95,47.83 14.48,41.27 v14.48,40.51
  Bottom 0.254: H4.2 60.96,49.53 62.87,47.62 62.87,37.85 59.54,34.53 58.69,34.53 v58.42,34.8 | v20.83,39.62 20.83,45.97 18.16,48.64 18.16,50.16 v18.29,50.29
D2  (via drill 0.4)
  Top 0.254: IC5.32 60.53,35.31 v59.31,35.31 | v60.07,48.64 59.05,47.62 30.73,47.62 v30.48,47.37 | v28.32,33.53 28.32,33.27 25.4,30.35
  Bottom 0.254: H4.3 58.42,50.29 v60.07,48.64 60.96,48.64 62.23,47.37 62.23,38.15 59.41,35.33 59.33,35.33 v59.31,35.31 | v30.48,47.37 29.72,46.61 29.72,34.16 29.08,33.53 v28.32,33.53
D3  (via drill 0.4)
  Top 0.254: IC5.1 59.82,36.83 v59.94,36.96
  Bottom 0.254: v59.94,36.96 61.59,38.61 61.59,47.12 60.96,47.75 59.44,47.75 57.91,49.28 56.9,49.28 55.88,50.29 H4.4
D4  (via drill 0.4)
  Top 0.254: v58.29,38.23 58.29,36.85 IC5.2 | RN6.5 54.41,26.6 v54.74,26.92 | v57.78,31.55 v57.78,32.97
  Bottom 0.254: H4.5 53.34,50.29 54.36,49.28 56.01,49.28 56.64,48.64 57.66,48.64 59.18,47.12 60.58,47.12 60.96,46.74 60.96,39.37 59.82,38.23 v58.29,38.23 58.29,36.45 57.53,34.67 57.51,33.22 v57.78,32.97 | v54.74,26.92 56.52,26.92 57.78,28.19 v57.78,31.55
D5  (via drill 0.4)
  Top 0.254: IC5.9 51.99,35.31 v54.48,35.31
  Bottom 0.254: v54.48,35.31 54.48,37.85 48.9,43.43 48.9,48.64 50.8,50.55 H4.6
D6  (via drill 0.4)
  Top 0.254: IC5.10 51.98,34.54 52.83,34.54 53.09,34.8 53.85,34.8 54.23,34.42 v54.86,34.42
  Bottom 0.254: v54.86,34.42 54.23,34.42 53.72,34.92 53.72,37.85 48.26,43.31 H4.7
D7  (via drill 0.4)
  Top 0.254: IC5.11 53.16,33.73 v53.47,34.04
  Bottom 0.254: H4.8 45.72,50.55 47.62,48.64 47.62,43.18 53.09,37.72 53.09,34.42 v53.47,34.04
D8  (via drill 0.4)
  Top 0.254: IC5.12 52.7,32.89 53.06,33.25 54.12,33.26 v54.36,33.53
  Bottom 0.254: H1.1 43.31,50.8 44.7,49.4 45.97,49.4 46.99,48.39 46.99,42.93 52.45,37.47 52.45,33.78 52.96,33.27 54.1,33.27 v54.36,33.53
D9  (via drill 0.4)
  Top 0.254: IC5.13 52.7,32.13 53.09,32.51 v53.98,32.51
  Bottom 0.254: v53.98,32.51 52.32,32.51 51.82,33.02 51.82,37.21 46.35,42.67 46.35,48.13 45.72,48.77 44.45,48.77 43.81,49.4 40.01,49.4 39.12,50.29 H1.2
D10_SS  (via drill 0.4)
  Top 0.254: IC5.14 52.87,31.33 v53.34,31.75
  Bottom 0.254: v53.34,31.75 53.21,31.88 46.35,31.88 45.21,33.02 36.83,33.02 36.45,32.64 36.45,50.67 H1.3
D11_MOSI  (via drill 0.4)
  Top 0.203: v49.4,26.54 50.8,27.94 v50.8,29.08 50.8,29.97 51.36,30.53 IC5.15
  Top 0.254: IC5.15 56.72,30.53 57.91,29.34 59.44,29.34 62.1,26.67 64.52,26.67 | 64.52,26.67 64.58,26.67 | 64.52,26.67 65.74,27.89 P2.4 | RN6.6 53.61,26.65 v53.34,26.92
  Bottom 0.203: 34.04,29.97 35.18,29.97 37.59,32.38 41.27,32.38 43.05,30.61 48.9,30.61 50.42,29.08 v50.8,29.08
  Bottom 0.254: v53.34,26.92 52.96,26.54 v49.4,26.54 | H1.4 33.91,50.67 33.91,30.23 34.04,30.1 34.04,29.97
D12_MISO  (via drill 0.4)
  Top 0.203: v51.82,28.83 51.94,28.96 51.94,29.7 IC5.16
  Top 0.254: P4.7 62.9,12.16 62.87,12.19 v64.26,12.19
  Bottom 0.203: 33.15,30.23 33.15,29.46 33.4,29.21 35.18,29.21 37.85,31.88 41.15,31.88 42.93,30.1 48.64,30.1 50.42,28.32 51.18,28.32 v51.82,28.83 51.82,29.97 52.83,30.99 53.59,30.99 55.75,33.15 56.77,33.15 57.4,32.26 61.59,32.26 61.72,32.38 62.74,32.38 63.63,31.5 63.63,30.44 P2.1
  Bottom 0.254: v64.26,12.19 64.26,21.97 62.36,23.88 62.36,28.45 63.64,29.73 P2.1 | H1.5 33.4,48.9 33.4,30.35 33.15,30.1 33.15,30.23
D13_SCK  (via drill 0.4)  (1 unrouted)
  Top 0.254: P2.3 64.9,29.15 64.9,29.21 | 64.9,29.21 64.9,30.99 66.17,32.26 66.17,33.02 65.91,33.27 65.15,33.27 64.77,32.89 63.5,32.89 63.25,33.15 63.25,34.04 62.55,34.73 Q2.1 | 53.46,28.32 52.45,27.3 52.45,26.8 52.83,26.42 52.83,26.09 RN6.7 | v53.47,29.59 v53.46,29.59 53.46,28.32 | 53.46,28.32 IC5.17 | 64.9,29.21 66.8,29.21 67.44,28.57 67.44,27.18 66.8,26.54 65.28,26.54 64.9,26.16 64.9,24.51 65.15,24.26 65.15,22.23 64.52,21.59 57.4,21.59 v56.52,22.48
  Bottom 0.203: 43.18,29.46 48.64,29.46 51.05,27.05 52.28,27.05 52.98,27.75 53.66,27.75 | v56.52,22.48 54.08,24.92 54.08,27.33 53.66,27.75 | 53.66,27.75 53.47,27.94 v53.47,29.59 arc91 53.46,29.46 IC5.17
  Bottom 0.254: 32.89,32.64 32.89,46.99 H1.6
DTR  (via drill 0.4)
  Top 0.203: IC3.13 v9.66,51.69 v9.65,51.69 | 35.69,42.04 SJ3.1
  Top 0.254: v35.69,43.43 35.69,42.04 | C19.1 38.19,42.51 37.59,41.91 SJ3.2 SJ3.1
  Bottom 0.203: v9.65,51.69 9.65,51.49 SJ2.2 12.11,50.46 13.59,51.94 13.59,52.32 14.1,52.7 34.8,52.7 35.31,52.2 35.31,43.81 v35.69,43.43
GND  (via drill 0.4)  (1 unrouted)
  Top 0.203: v30.99,32.51 31.62,32.51 32.64,33.53 33.02,33.53 | IC3.3 12.19,47.75
  Top 0.254: C3.C 33.14,36.45 v31.62,36.45 | IC3.3 10.66,47.76 IC3.EXP | 12.19,47.75 13.72,47.75 14.1,48.13 18.41,48.13 | C11.2 1.44,44.66 v1.85,44.2 | RN8.1 57.22,6.92 57.28,6.86 58.02,6.86 | RN8.3 58.8,7.43 58.8,6.99 58.67,6.86 58.02,6.86 | RN8.2 58.02,6.86 | P4.6 61.73,13.22 v61.59,13.08 | Q2.2 62.55,32.83 63.12,32.26 65.15,32.26 v65.41,32.51 | IC5.21 56.66,29.57 v56.52,29.72 | v56.44,32.38 56.44,32.72 57.53,33.78 57.53,35.43 57.28,35.69 | v67.44,32.51 68.07,31.88 68.07,25.65 67.77,25.35 P2.6
  Top 0.305: IC5.5 55.88,36.8 55.88,35.69 57.28,35.69 57.4,35.69 57.46,35.74 IC5.3 57.46,38.13 56.77,38.86 C27.2
  Top 0.406: v50.67,11.68 C29.2 | C27.2 56.73,39.88 | 56.73,39.88 C20.1 | 56.73,39.88 v57.78,39.88 | 38.61,15.37 38.61,15.49 37.85,16.26 36.7,16.26 36.2,16.76 IC1.1 | 38.61,15.37 C7.2 | 38.61,15.37 40.47,15.37 C9.2 | C14.2 27.27,37.55 28.57,38.86 28.87,38.86
  Top 0.508: 49.78,30.1 50.04,30.1 50.8,30.86 50.8,31.24
  Top 0.61: 66.8,23.37 66.75,23.42 66.75,24.78 P2.6
  Top 1.016: IC1.1 34.32,17.5 v34.29,17.53
  Bottom 0.254: v1.85,44.2 2.67,44.19 SJ1.2 | v56.52,29.72 57.15,30.35 57.15,31.24 56.9,32 v56.44,32.38 | SJ2.1 11.98,48.94 12.7,49.66 13.46,49.66 14.48,48.64 15.37,48.64 v16.13,47.88 | v67.44,32.51 v65.41,32.51
  Bottom 0.406: SJ1.1 SJ1.2
  other vias: 48.26,2.54 58.29,20.7 58.29,19.94 21.46,47.88 2.54,51.82 35.05,17.53 27.94,38.23 31.62,46.86 41.66,46.1 1.02,48.01 51.18,22.1 51.94,22.1 65.15,20.7 65.15,19.94 49.4,27.69 50.29,33.53 65.02,50.8 52.2,48.51 19.94,43.31 48.26,1.65 30.61,2.41 48.26,5.21 48.26,6.1 34.8,32.05 37.47,34.98 43.94,32.13 2.87,39.37 4.9,37.59
  pour Bottom: 0,50.8 arc-74 2.54,53.34 63.5,53.34 arc-74 66.04,50.8 66.04,40.64 68.58,38.1 68.58,5.08 66.04,2.54 arc-74 63.5,0 2.54,0 arc-74 0,1.91
  pour Top: 0,50.8 arc-74 2.54,53.34 63.5,53.34 arc-74 66.04,50.8 66.04,40.64 68.58,38.1 68.58,5.08 66.04,2.54 arc-74 63.5,0 2.54,0 arc-74 0,1.91
MISO2  (via drill 0.4)
  Top 0.203: IC3.17 7.61,50.69 v6.6,51.69
  Bottom 0.203: v6.6,51.69 8.38,49.91 8.38,48.01 15.37,41.02 15.37,37.47 16.13,36.7 18.03,36.7 18.54,36.2 18.54,32.38 19.05,31.88 20.45,31.88 21.08,32.51 21.08,34.04 22.35,35.31 P3.1
MOSI2  (via drill 0.4)
  Top 0.203: IC3.16 8.16,51.15 v7.62,51.69
  Bottom 0.203: v7.62,51.69 8.89,50.42 8.89,48.13 15.88,41.15 15.88,37.69 16.41,37.16 20.37,37.16 21.08,36.45 21.08,34.92 19.81,33.66 P3.4
N$2
  Top 0.254: IC5.7 54.26,37.43 53.05,38.65 R7.2 54.83,40.77 C20.2 55.03,43.47 X3.2
N$4
  Top 0.254: R8.2 61.63,37.5 62.36,38.23 LED10.C
N$6
  Top 0.254: R8.1 63.33,35.17 64.14,34.42 64.14,33.87 Q2.3
N$7
  Top 0.254: IC5.8 52.97,36.82 51.44,38.35 51.44,38.9 R7.1 53.05,40.69 C21.2 53.05,41.82 X3.1
N$8
  Top 0.203: R2.1 14.1,44.54 14.1,46.61 13.94,46.76 IC3.1
N$9
  Top 0.254: Z1.2 10.16,37.08 10.67,36.58 11.81,36.58 12.45,35.94 12.45,32.64 12.06,32.26 7.49,32.26 7.11,32.64 7.11,33.56 P1.SH4
  Top 0.406: P1.SH4 6.99,33.53 6.6,33.86 2.29,33.86 1.98,33.6 P1.SH1 P1.SH2 | P1.SH2 4.83,42.6 | 4.83,42.6 P1.SH3 8.95,42.6 9.14,42.8 10.12,42.8 Z2.2 | P1.SH2 1.52,42.65 | 4.83,42.6 L3.1
N$11
  Top 0.203: LED6.C 3.25,47.06 2.79,47.5 2.79,49.28 3.17,49.66 3.68,49.66 4.06,50.04 4.59,50.04 RN3.2
N$12
  Top 0.254: RN4.5 33.2,43.25 33.02,43.43 32.51,43.43 | 32.51,43.43 32.38,43.31 32.38,42.6 RN4.6 | 32.51,43.43 29.08,46.86 25.27,46.86 24.89,46.48 IC4.3
N$13
  Top 0.203: LED5.C 3.92,50.65 4.06,50.8 4.55,50.8 RN3.1
N$14  (via drill 0.4)
  Top 0.203: RN6.8 51.73,26.07 v51.05,25.4
  Top 0.254: LED2.C 62.88,40.78 63.12,41.02 65.02,41.02 65.41,40.64 65.41,39.5 v65.91,38.99 | v56.64,23.5 56.77,23.62 v63.75,23.62
  Bottom 0.254: v65.91,38.99 65.91,38.35 64.01,36.45 64.01,32.77 65.15,31.62 66.8,31.62 67.44,30.99 67.44,24.51 66.55,23.62 v63.75,23.62 | v56.64,23.5 57.02,23.5 57.28,23.24 57.28,21.84 56.77,21.34 55.12,21.34 v51.05,25.4
N$16
  Top 0.254: Z1.1 10.24,39.2 R5.2
  Top 0.305: P1.D+ 8.51,38.1 9.53,39.12 10.07,39.12 Z1.1
N$17
  Top 0.254: Z2.1 R4.2
  Top 0.305: P1.D- 8.42,38.9 8.89,39.37 8.89,40.51 9.4,41.02 10.12,41.02 Z2.1
N$18
  Top 0.254: 24.89,38.48 IC4.6 | 24.89,38.48 25.78,38.48 26.16,38.86 IC4.7 | 24.7,35.24 Q1.1 24.81,36.15 24.51,36.45 24.51,38.1 24.89,38.48
N$19
  Top 0.254: IC4.5 23.62,41.27 24.38,42.04 26.54,42.04 27.43,42.93 IC4.1
N$20  (via drill 0.4)
  Top 0.254: RN6.4 54.41,22.68 59.44,17.65 v61.21,17.65 62.46,17.65 P4.2 | RN8.8 57.22,11.5 v59.94,14.22
  Bottom 0.254: v59.94,14.22 61.21,15.49 v61.21,17.65
N$21
  Top 0.254: 56.9,26.54 56.9,26.92 57.46,27.5 IC5.22
  Top 0.305: 56.9,26.54 58.04,25.4 A7.1
N$22
  Top 0.254: 56.13,26.54 55.06,27.62 IC5.19
  Top 0.305: 56.13,26.54 A6.1
N$23
  Top 0.254: P4.CD1 55.61,11.83 56.01,11.43 56.01,5.59 56.9,4.7 60.2,4.7 61.98,6.48 CD.1
N$24
  Top 0.254: RN6.2 52.81,22.5 57.78,17.53 57.78,15.62 58.29,15.11 60.33,15.11 61.21,14.22 | 61.21,14.22 62.8,14.22 P4.5 | RN8.7 58.02,9.51 60.07,11.56 60.07,13.08 61.21,14.22
N$25
  Top 0.254: RN6.3 53.61,22.59 59.69,16.51 62.89,16.51 P4.3 64.77,16.51 65.15,16.13 65.15,11.94 64.26,11.05 64.26,10.29 64.01,10.03 59.44,10.03 58.82,9.42 RN8.6
N$60
  Top 1.676: J1.PWR 12.22,7.58 D1.A
N$113
  Top 0.203: IC3.2 12.27,47.2 R1.2 15.07,47.12 15.75,47.12 17.14,45.72 X1.2 18.88,46.06 C2.2
N$114
  Top 0.203: R2.2 16.26,41.95 | 16.26,41.95 17.49,41.95 X1.1 18.63,40.81 C8.2 | R1.1 15.07,45.59 15.75,45.59 16.26,45.09 16.26,41.95
N$115
  Top 0.61: P1.VBUS 5.54,39.7 3.17,37.34 3.17,35.43 3.94,34.67 5.05,34.67 5.69,35.31 9.61,35.31 F1.1
N$117
  Top 0.203: 9.14,46.2 9.14,45.72 8.89,45.47 7.87,45.47 7.49,45.85 3.9,45.85 C11.1
  Top 0.254: 9.14,46.2 IC3.27
RD+  (via drill 0.4)
  Top 0.254: R5.1 11.98,39.24 v12.95,39.24 | v10.16,43.94 IC3.29
  Bottom 0.254: v12.95,39.24 12.95,41.15 v10.16,43.94
RD-
  Top 0.254: R4.1 11.98,42.84 11.99,42.85 11.96,43 11.96,43.54 10.66,44.84 IC3.30
RESET  (via drill 0.4)
  Top 0.203: RN4.2 31.6,41.76 31.75,41.91 34.29,41.91 34.42,41.78 34.42,40.89 34.67,40.64 37.97,40.64 38.14,40.81 C19.2
  Top 0.254: IC2.3 40.72,16.64 41.27,16.64 42.42,15.49 42.42,13.72 41.4,12.7 40.26,12.7 39.75,12.19 39.75,10.67 40.26,10.16 40.26,7.11 37.97,4.83 34.16,4.83 33.02,3.68 H2.1 34.16,1.4 38.86,1.4 39.37,1.91 39.37,3.17 40.13,3.94 51.18,3.94 52.2,4.95 v52.32,4.95 | IC5.29 59.22,32.93 v59.05,33.02 | v64.26,42.93 64.52,42.67 S1.4 S1.3 59.44,43.18 56.01,46.61 43.69,46.61 42.55,45.47 42.55,41.15 41.78,40.39 40.26,40.39 39.79,40.81 C19.2 | v58.04,22.48 64.14,22.48 64.52,22.86 64.52,24 63.63,24.89 63.63,25.34 P2.5
  Bottom 0.254: P2.5 64.9,26.61 64.9,30.99 62.36,33.53 60.96,33.53 | v64.26,42.93 64.26,37.47 60.96,34.16 60.96,33.53 | v52.32,4.95 53.98,4.95 57.66,8.64 57.66,14.61 59.31,16.26 59.31,21.59 58.42,22.48 v58.04,22.48 | v59.05,33.02 59.56,33.53 60.96,33.53
RESET2  (via drill 0.4)
  Top 0.203: IC3.24 5.87,46.76 v5.71,46.61
  Top 0.254: P3.5 17.27,36.7 17.78,37.21 20.19,37.21 21.08,38.1 v23.62,38.1 | v28.45,40.39 30.48,40.39 30.73,40.64 30.73,41.16 RN4.1
  Bottom 0.203: v5.71,46.61 5.71,45.85 6.22,45.34 8.76,45.34 9.4,44.7 9.4,43.69 11.3,41.78 11.3,39.24 14.99,35.56 P3.5
  Bottom 0.254: v23.62,38.1 26.16,38.1 v28.45,40.39
RXLED
  Top 0.203: IC3.10 11.16,52.22 10.54,52.83 5.97,52.83 5.28,52.15 5.28,50.22 5.46,50.04 5.94,50.04 RN3.7
SCK2  (via drill 0.4)
  Top 0.203: IC3.15 8.66,51.67 v8.64,51.69 | v21.46,37.21 P3.3
  Bottom 0.203: v8.64,51.69 9.4,50.93 9.4,48.26 16.38,41.27 16.38,37.97 16.76,37.59 21.08,37.59 v21.46,37.21
TXLED
  Top 0.203: IC3.11 10.66,51.95 10.21,52.4 6.17,52.4 5.84,52.07 5.84,51.56 5.97,51.44 5.97,50.87 RN3.8
USBRXD  (via drill 0.4)
  Top 0.203: RN3.5 6.69,48.46 v6.76,48.51 | IC3.9 11.66,51.15 v12.06,51.56
  Bottom 0.203: v12.06,51.56 11.25,52.38 6.15,52.38 5.84,52.07 5.84,51.44 7.62,49.66 7.62,48.9 7.24,48.51 v6.76,48.51
USBTXD  (via drill 0.4)
  Top 0.203: RN3.6 6.51,49.26 v6.76,49.51 | IC3.8 12.83,50.88 v12.83,52.2
  Bottom 0.203: v12.83,52.2 12.19,52.83 5.84,52.83 5.33,52.32 5.33,50.16 5.99,49.51 v6.76,49.51
USBVCC
  Top 0.254: IC3.31 11.16,45.1 11.81,44.45 12.57,44.45 13.72,43.31 13.72,37.08 14.35,36.45 14.35,34.46 F1.2
  Top 0.61: F1.2 14.4,32.34 15.62,31.11 22.86,31.11 23.62,31.88 25.74,31.88 27.01,33.15 Q1.3 27.05,34.16
VIN  (via drill 0.4)  (1 unrouted)
  Top 0.254: RN4.3 32.4,40.79 31.88,40.26 v31.5,40.26
  Top 1.016: IC1.3 31.63,16.52 27.56,16.51 27.56,10.79 25.4,8.64 23.62,8.64 | 23.62,8.64 20.83,8.64 | v23.88,2.16 23.62,2.16 | v23.11,2.16 23.62,2.16 | 23.62,2.16 23.62,8.64
  Top 1.422: C5.+ 20.83,8.64 20.83,9.4 18.25,11.98 D1.C
  Bottom 0.254: v31.5,40.26 31.5,38.61 32.38,37.72 32.38,32.89 31.24,31.75
  Bottom 1.016: H2.6 45.72,1.52 45.09,0.89 25.15,0.89 v23.88,2.16 v23.11,2.16
WIZRST
  Top 0.203: IC2.2 40.23,19.19

### Text on the board
tPlace: USB | TX | RX | A | GND | 13 | 12 | 11 | 10 | 9 | 8 | 7 | 6 | 5 | 4 | 3 | 2 | 1 | 0 | REF | PWM | PWM | PWM | Digital | PWM | PWM | PWM | TX | RX | EtherTen | www.freetronics.com | RST | RST-EN | PWR | D13 | ICSP | freetronics | A6 | A7 | 7-12V | DC | microSD | C | D | 2.1mm | Power | Analog | RST | 3V3 | 5V | GND | GND | VIN | 0 | 1 | 2 | 3 | 4 | 5
bPlace: A | GND | 13 | 12 | 11 | 10 | 9 | 8 | 7 | 6 | 5 | 4 | 3 | 2 | 1 | 0 | UBOOT | REF | PWM | PWM | PWM | Digital | PWM | PWM | PWM | TX | RX | GND | freetronics | EtherTen | v1.1 | www.freetronics.com/etherten | CC | ROHS | by Marc Alexander | SKU: | Power | Analog | ETHERTEN | RST | 3V3 | 5V | GND | GND | VIN | 0 | 1 | 2 | 3 | 4 | 5